# EAGLE design v4.5 (EAGLE 7.5.0)
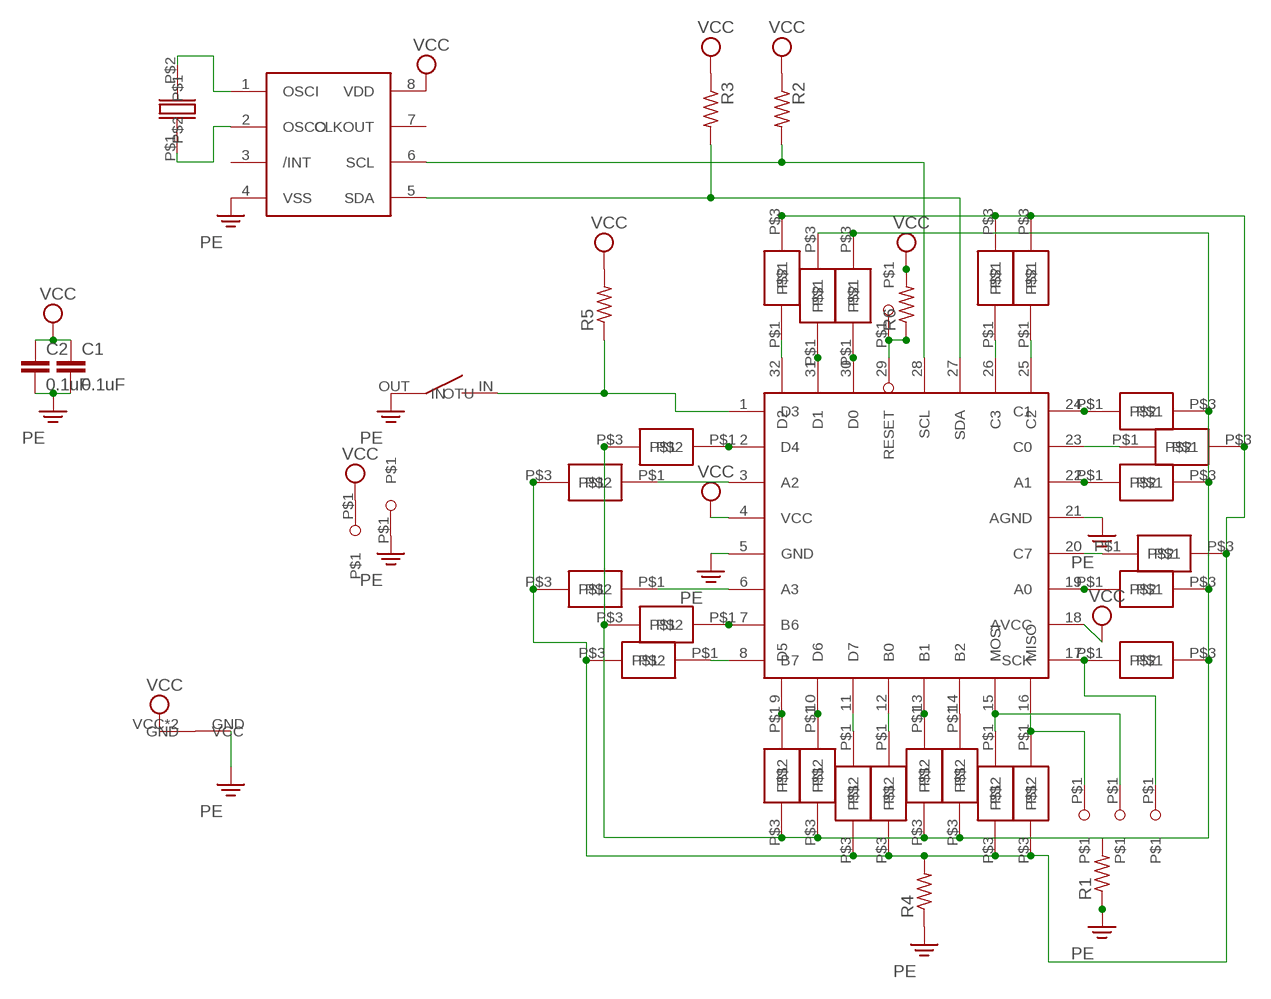
[diagram p0: schematic, sheet 1]

## Parts
C1  0.1uF  C-EUC0805K  [C0805K]
C2  0.1uF  C-EUC0805K  [C0805K]
R1  R-US_R0805  [R0805]
R2  R-US_R0805  [R0805]
R3  R-US_R0805  [R0805]
R4  R-US_R0805  [R0805]
R5  R-US_R0805  [R0805]
R6  R-US_R0805  [R0805]
U$1  SMDLED  [SMDLED]
U$2  SMDLED  [SMDLED]
U$3  SMDLED  [SMDLED]
U$4  SMDLED  [SMDLED]
U$5  SMDLED  [SMDLED]
U$6  SMDLED  [SMDLED]
U$7  SMDLED  [SMDLED]
U$8  SMDLED  [SMDLED]
U$9  SMDLED  [SMDLED]
U$10  SMDLED  [SMDLED]
U$11  SMDLED  [SMDLED]
U$12  SMDLED  [SMDLED]
U$13  SMDLED  [SMDLED]
U$14  SMDLED  [SMDLED]
U$15  SMDLED  [SMDLED]
U$16  SMDLED  [SMDLED]
U$17  SMDLED  [SMDLED]
U$18  SMDLED  [SMDLED]
U$19  SMDLED  [SMDLED]
U$20  SMDLED  [SMDLED]
U$21  SMDLED  [SMDLED]
U$22  SMDLED  [SMDLED]
U$23  SMDLED  [SMDLED]
U$24  SMDLED  [SMDLED]
U$25  ATTINY88  [32-TQFT]
U$26  PAD50  [PAD50]
U$27  BAT2009  [BAT2009]
U$28  INT2  [INT2]
U$29  SMDCRYSTAL  [SMDCRYSTAL]
U$30  RTC-SOIC  [8-SOIC]
U$31  PAD50  [PAD50]
U$32  PAD50  [PAD50]
U$33  PAD50  [PAD50]
U$34  PAD50  [PAD50]
U$35  PAD50  [PAD50]

## Nets
N$1: U$17.P$1 U$25.6(A3)
N$2: U$16.P$1 U$25.3(A2)
N$3: U$7.P$1 U$25.7(B6)
N$4: U$8.P$1 U$25.8(B7)
N$5: U$18.P$1 U$25.9(D5)
N$6: U$19.P$1 U$25.10(D6)
N$7: U$20.P$1 U$25.11(D7)
N$8: U$1.P$1 U$25.12(B0)
N$9: U$2.P$1 U$25.13(B1)
N$10: R1.2 U$2.P$3 U$3.P$3 U$6.P$3 U$7.P$3 U$11.P$3 U$12.P$3 U$13.P$3 U$15.P$3 U$18.P$3 U$19.P$3 U$21.P$3 U$23.P$3
N$11: U$3.P$1 U$25.14(B2)
N$12: R4.2 U$1.P$3 U$4.P$3 U$5.P$3 U$8.P$3 U$9.P$3 U$10.P$3 U$14.P$3 U$16.P$3 U$17.P$3 U$20.P$3 U$22.P$3 U$24.P$3
N$13: U$11.P$1 U$25.17(SCK) U$33.P$1
N$14: U$24.P$1 U$25.26(C3)
N$15: U$9.P$1 U$25.25(C2)
N$16: U$6.P$1 U$25.24(C1)
N$17: U$22.P$1 U$25.23(C0)
N$18: U$21.P$1 U$25.22(A1)
N$19: R5.1 U$25.1(D3) U$28.IN
N$20: U$10.P$1 U$25.20(C7)
N$21: U$23.P$1 U$25.30(D0)
N$22: U$13.P$1 U$25.31(D1)
N$23: U$14.P$1 U$25.32(D2)
N$24: U$15.P$1 U$25.2(D4)
N$25: U$29.P$2 U$30.1(OSCI)
N$26: U$12.P$1 U$25.19(A0)
N$29: U$29.P$1 U$30.2(OSCO)
N$30: R6.1 U$25.29(RESET) U$26.P$1
N$31: U$5.P$1 U$25.16(MISO) U$32.P$1
N$34: U$4.P$1 U$25.15(MOSI) U$31.P$1
PE: C1.2 C2.2 R1.1 R4.1 U$25.5(GND) U$25.21(AGND) U$27.GND U$28.OUT(OTU) U$30.4(VSS) U$34.P$1
SCL: R2.2 U$25.28(SCL) U$30.6(SCL)
SDA: R3.2 U$25.27(SDA) U$30.5(SDA)
VCC: C1.1 C2.1 R2.1 R3.1 R5.2 R6.2 U$25.4(VCC) U$25.18(AVCC) U$27.VCC U$27.VCC2(VCC) U$30.8(VDD) U$35.P$1
Unconnected: U$30.3(/INT) U$30.7(CLKOUT)

## Library data of the parts
C1 C2 = rcl:C-EU: CAPACITOR, European symbol
R1-R6 = resistor:R-US_: RESISTOR, American symbol
U$1-U$24 = custom:SMDLED
U$25 = _custom:ATTINY88
U$26 U$31-U$35 = _custom:PAD50
U$27 = custom:BAT2009
U$28 = custom:INT2
U$29 = _custom:SMDCRYSTAL
U$30 = _custom:RTC-SOIC

## Board
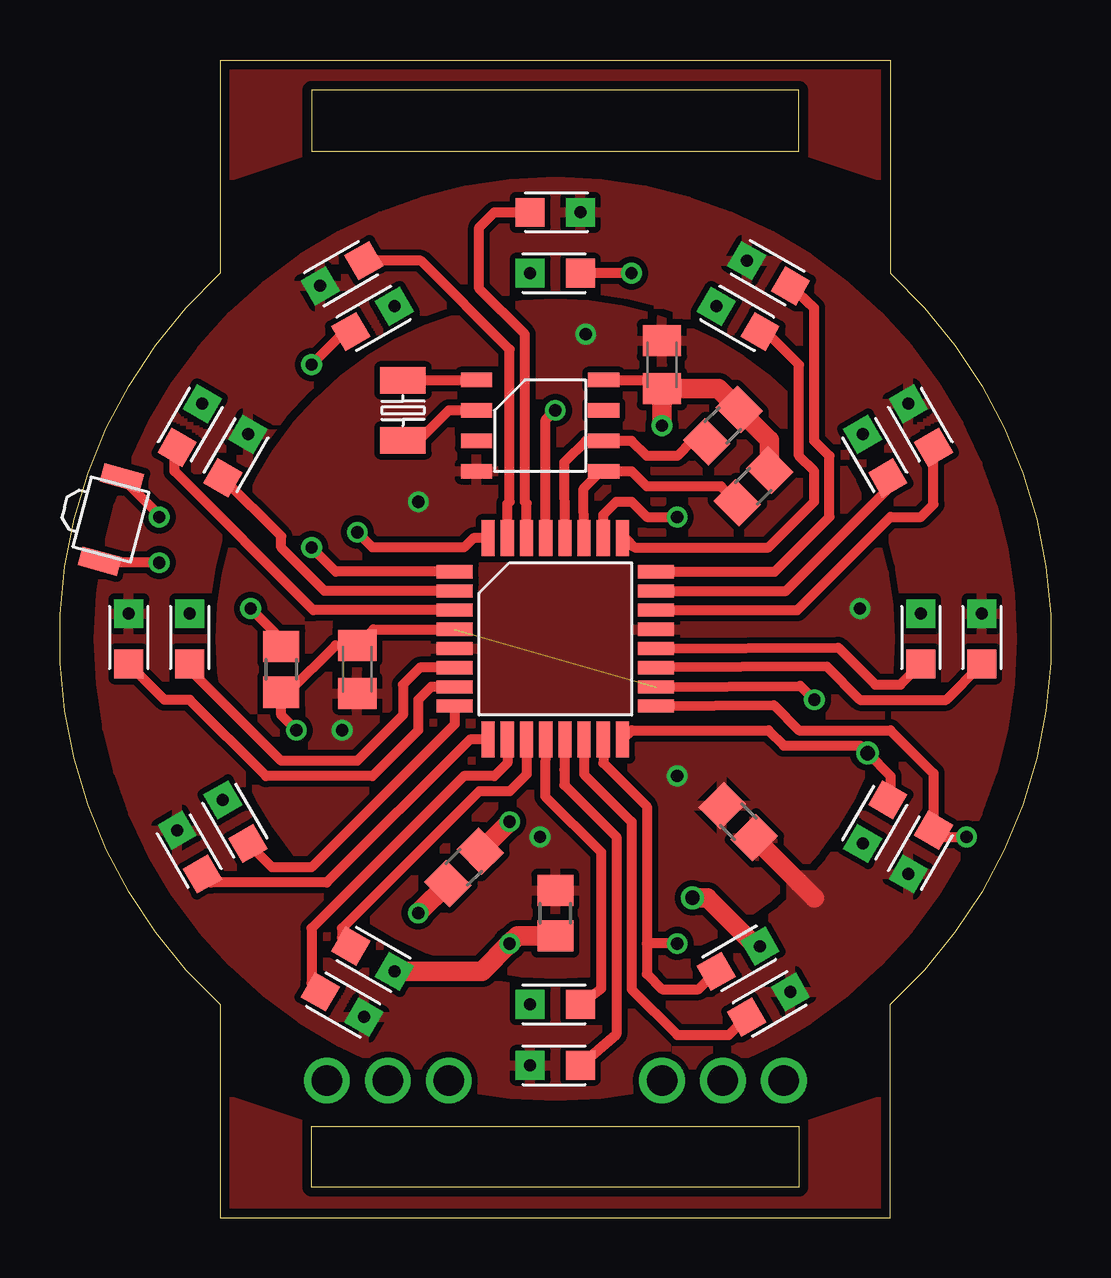
[diagram p1: board, top side]
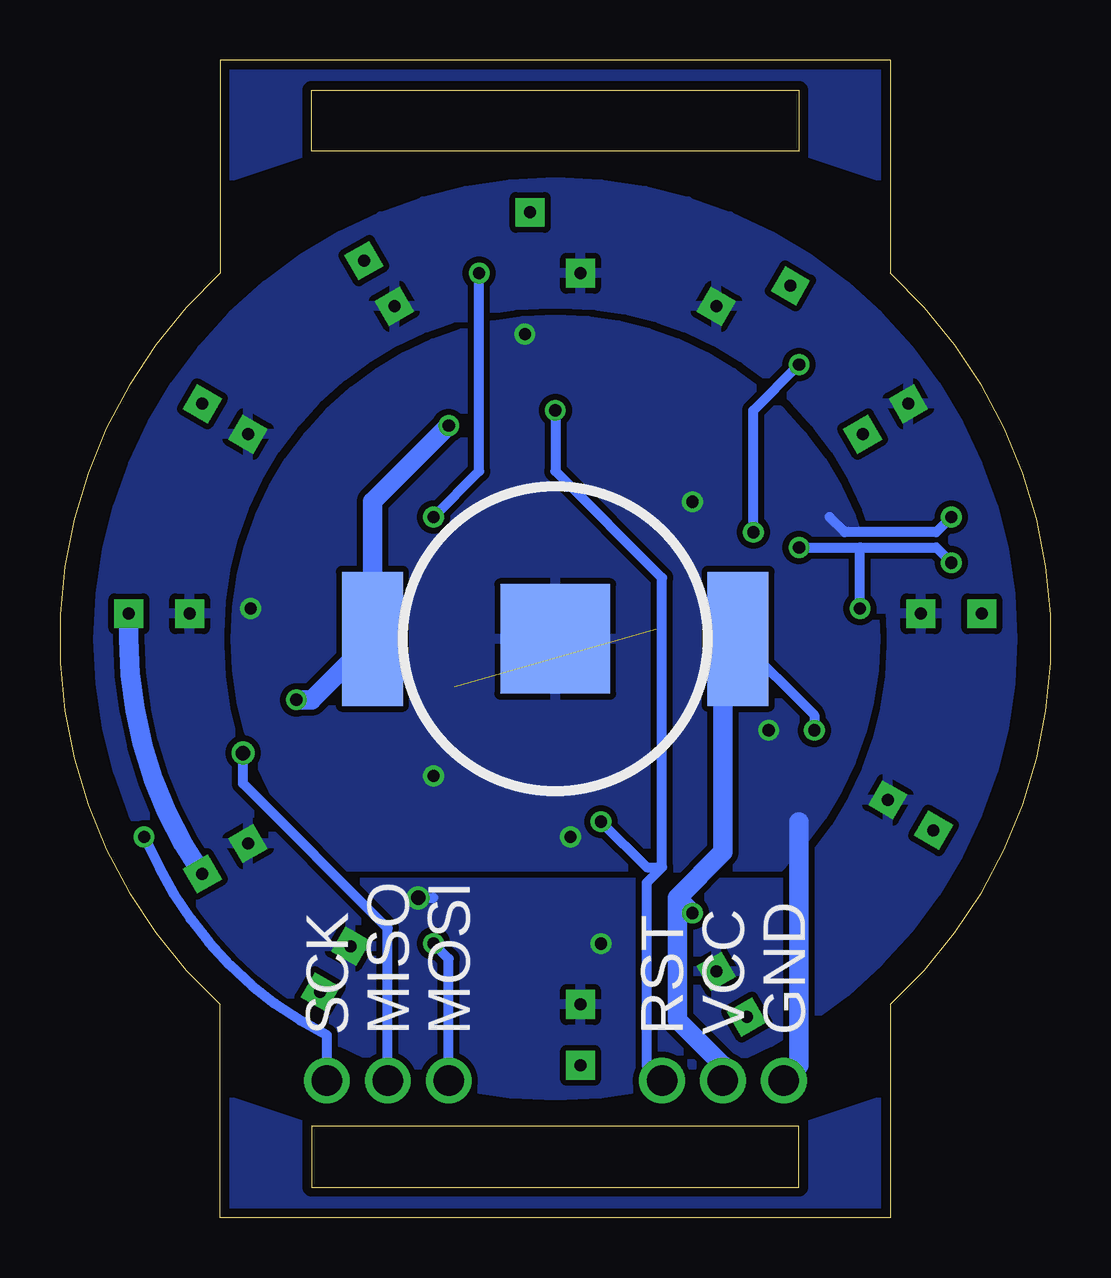
[diagram p2: board, bottom side, seen from below]

Size 41.3 x 48.26 mm. Coordinates in mm from the lower left corner, seen from the top.
Outline: 6.68,48.26 34.62,48.26 34.62,39.37 arc-95 34.62,8.89 34.62,0 6.68,0 6.68,8.89 arc-95 6.68,39.37 6.68,48.26
Outline: 30.81,46.99 10.49,46.99 10.49,44.45 30.81,44.45 30.81,46.99
Outline: 30.81,1.27 10.49,1.27 10.49,3.81 30.81,3.81 30.81,1.27
Copper layers (1*16): Top 0.0356mm / dielectric 1.5011mm / Bottom 0.0356mm
Design rules "oshpark-2layer": minimum track width 6mil, minimum drill 13mil, track to track 6mil, track to pad 6mil, pad to pad 6mil, via to via 6mil, smd to smd 6mil, copper to edge 15mil, drill to drill 6mil, minimum pad ring 7mil, minimum via ring 7mil, stop-mask expansion 2.5mil, vias tented up to drill 0mil, thermal gap 10mil

### Footprints (pad centres in the part's own frame; a part is rotated, then mirrored left to right if it is on the bottom)
C0805K = smd 1.3 x 1.6: 1 -1,0; 2 1,0
R0805 = smd 1.3 x 1.5: 1 -0.95,0; 2 0.95,0
SMDLED = smd 1.2 x 1.2: P$1 0,1.05 | drill 0.5 pad 1.2 square: P$3 0,-1.05
32-TQFT = smd 1.5 x 0.55: 1 -4.2,2.8; 2 -4.2,2; 3 -4.2,1.2; 4 -4.2,0.4; 5 -4.2,-0.4; 6 -4.2,-1.2; 7 -4.2,-2; 8 -4.2,-2.8; 17 4.2,-2.8; 18 4.2,-2; 19 4.2,-1.2; 20 4.2,-0.4; 21 4.2,0.4; 22 4.2,1.2; 23 4.2,2; 24 4.2,2.8 | smd 0.55 x 1.5: 9 -2.8,-4.2; 10 -2,-4.2; 11 -1.2,-4.2; 12 -0.4,-4.2; 13 0.4,-4.2; 14 1.2,-4.2; 15 2,-4.2; 16 2.8,-4.2; 25 2.8,4.2; 26 2,4.2; 27 1.2,4.2; 28 0.4,4.2; 29 -0.4,4.2; 30 -1.2,4.2; 31 -2,4.2; 32 -2.8,4.2
PAD50 = drill 1.27: P$1 0,0
BAT2009 = smd 4.572 x 4.572: GND 0,0 | smd 2.54 x 5.588: VCC -7.62,0; VCC2 7.62,0
INT2 = smd 0.8 x 1.7: IN -1.8,0; OUT 1.8,0
SMDCRYSTAL = smd 1.1 x 1.9: P$1 -1.25,0; P$2 1.25,0
8-SOIC = smd 1.3 x 0.6: 1 -2.65,1.905; 2 -2.65,0.635; 3 -2.65,-0.635; 4 -2.65,-1.905; 5 2.65,-1.905; 6 2.65,-0.635; 7 2.65,0.635; 8 2.65,1.905

### Placement (x,y rotation side)
C1  12.39,22.86 270 top
C2  25.09,35.56 90 top
R1  28.27,16.51 315 top
R2  27.63,33.02 225 top
R3  28.9,30.48 225 top
R4  20.65,12.7 270 top
R5  9.22,22.86 270 top
R6  16.84,14.61 225 top
U$1  20.65,8.89 270 top
U$2  20.65,6.35 270 top
U$3  29.54,8.89 120 top
U$4  28.27,10.8 120 top
U$5  33.98,16.51 330 top
U$6  29.54,39.37 240 top
U$7  2.87,24.13 180 top
U$8  7.31,16.51 210 top
U$9  28.27,37.47 240 top
U$10  35.89,24.13 180 top
U$11  35.89,15.24 330 top
U$12  38.43,24.13 180 top
U$13  11.76,39.37 300 top
U$14  13.03,37.47 120 top
U$15  7.31,31.75 150 top
U$16  5.41,33.02 150 top
U$17  5.41,24.13 180 top
U$18  5.41,15.24 210 top
U$19  11.76,8.89 60 top
U$20  13.03,10.8 60 top
U$21  35.89,33.02 210 top
U$22  33.98,31.75 210 top
U$23  20.65,41.91 90 top
U$24  20.65,39.37 270 top
U$25  20.65,24.13 0 top
U$26  16.2,5.71 180 top
U$27  20.65,24.13 0 bottom
U$28  2.12,29.1 75 top
U$29  14.3,33.66 90 top
U$30  20.01,33.02 0 top
U$31  25.09,5.71 180 top
U$32  27.63,5.71 180 top
U$33  30.17,5.71 180 top
U$34  11.12,5.71 180 top
U$35  13.66,5.71 180 top

### Tracks (layer width: path | path; a pad name or v marks a point on that pad's centre or on a via)
N$1
  Top 0.406: U$25.6 15,22.93 14.3,22.22 14.3,20.96 12.39,19.05 9.22,19.05 5.41,22.86 U$17.P$1
N$2
  Top 0.406: U$25.3 10.56,25.33 4.77,31.11 4.77,32 U$16.P$1
N$3
  Top 0.406: U$25.7 15.47,22.13 14.93,21.59 14.93,20.32 13.03,18.41 8.58,18.41 5.41,21.59 4.36,21.59 U$7.P$1
N$4
  Top 0.406: U$25.8 16.45,20.57 10.49,14.61 8.84,14.61 U$8.P$1
N$5
  Top 0.406: U$25.9 17.08,19.93 11.12,13.97 6.3,13.97 U$18.P$1
N$6
  Top 0.406: U$25.10 18.65,18.96 18.11,18.41 16.84,18.41 10.49,12.07 10.49,9.78 U$19.P$1
N$7
  Top 0.406: U$25.11 19.45,18.48 18.74,17.78 17.47,17.78 11.76,12.07 11.76,11.68 U$20.P$1
N$8
  Top 0.406: U$1.P$1 22.55,9.55 22.55,15.24 20.23,17.57 20.23,18.2 U$25.12
N$9
  Top 0.406: U$2.P$1 23.19,7.64 23.19,15.88 21.03,18.04 21.03,18.67 U$25.13
N$10
  Top 0.813: R1.2 30.81,13.97 | 30.81,13.97 | 30.81,13.97 31.44,13.34
  Bottom 0.813: U$12.P$3 38.43,24.13 arc-35 U$11.P$3
  pour Top (isolate 0.254, rank 3): 20.65,43.18 arc180 20.65,5.08 arc180
N$11
  Top 0.406: U$25.14 21.85,18.48 23.82,16.51 23.82,9.53 25.73,7.62 27.89,7.62 U$3.P$1
N$12  (via drill 0.51, 0.6)
  Top 0.813: R4.2 19.06,11.75 v18.74,11.43 17.58,10.27 U$20.P$3 | U$4.P$3 29.01,11.32 27,13.34 v26.36,13.34
  Bottom 0.406: v26.36,13.34 25.73,13.34
  pour Bottom (isolate 0.254, rank 3): 20.65,43.18 arc180 20.65,5.08 arc180
  pour Bottom (isolate 0.254): 30.81,13.97 10.49,13.97 11.76,12.7 arc90 29.54,12.7
N$13  (via drill 0.51)
  Top 0.406: U$25.17 29.76,21.37 30.81,20.32 34.62,20.32 36.41,18.53 U$11.P$1 36.69,15.88 v37.79,15.88
  Bottom 0.406: v37.79,15.88 37.16,14.61 arc-37 30.17,7.62 U$33.P$1
N$14  (via drill 0.51)
  Top 0.406: U$25.26 22.65,29.31 23.19,29.85 23.82,29.85 24.46,29.21 v25.73,29.21 | v23.82,39.37 U$24.P$1
  Bottom 0.406: v25.73,29.21 23.82,31.11 v23.82,39.37
N$15
  Top 0.406: U$9.P$1 29.53,36.84 30.81,35.56 30.81,31.75 31.44,31.11 31.44,29.85 29.54,27.94 23.96,27.94 23.57,28.33 U$25.25
N$16
  Top 0.406: U$6.P$1 31.44,37.92 31.44,32.39 32.08,31.75 32.08,29.21 29.8,26.93 U$25.24
N$17
  Top 0.406: U$25.23 30.27,26.13 34.51,30.37 U$22.P$1
N$18
  Top 0.406: U$25.22 30.74,25.33 34.62,29.21 35.89,29.21 36.41,29.74 U$21.P$1
N$19  (via drill 0.51)
  Top 0.406: U$25.1 11.5,26.93 v10.49,27.94 | v4.14,27.31 1.72,27.31 U$28.IN | R5.1 9.22,24.13 v7.95,25.4
  Bottom 0.406: v10.49,27.94 7.95,27.94 | 7.95,27.94 4.77,27.94 v4.14,27.31 | v7.95,25.4 7.95,27.94
N$20
  Top 0.406: U$25.20 32.44,23.77 33.98,22.22 35.03,22.22 U$10.P$1
N$21
  Top 0.406: U$25.30 19.45,29.78 19.38,29.85 19.38,36.83 17.47,38.73 17.47,41.28 18.11,41.91 U$23.P$1
N$22
  Top 0.406: U$25.31 18.65,29.75 18.74,29.85 18.74,36.2 15.04,39.89 U$13.P$1
N$23  (via drill 0.51)
  Top 0.406: U$25.32 17.23,28.33 16.84,27.94 13.03,27.94 v12.39,28.57 | v10.49,35.56 11.87,36.94 U$14.P$1
  Bottom 0.406: v12.39,28.57 12.39,33.66 v10.49,35.56
N$24
  Top 0.406: U$25.2 11.03,26.13 9.22,27.94 9.22,28.41 U$15.P$1
N$25
  Top 0.406: U$29.P$2 14.32,34.92 U$30.1
N$26
  Top 0.406: U$12.P$1 36.94,21.59 33.35,21.59 31.97,22.97 U$25.19
N$27
  pour Top (isolate 0.254, rank 6): 6.68,48.26 34.62,48.26 34.62,43.18 30.81,44.45 30.81,46.99 10.49,46.99 10.49,44.45 6.68,43.18
N$28
  pour Bottom (isolate 0.254, rank 6): 6.68,48.26 34.62,48.26 34.62,43.18 30.81,44.45 30.81,46.99 10.49,46.99 10.49,44.45 6.68,43.18
N$29
  Top 0.406: U$30.2 16.2,33.66 14.95,32.41 U$29.P$1
N$30  (via drill 0.51)
  Top 0.406: U$25.29 20.25,33.25 v20.65,33.66
  Top 0.813: R6.1 v18.74,16.51
  Bottom 0.406: v20.65,33.66 20.65,31.11 16.2,26.67 16.2,14.61 | U$26.P$1 16.84,6.35 16.84,13.97 16.2,14.61 | v18.74,16.51 16.84,14.61 16.2,14.61
N$31  (via drill 0.6)
  Top 0.406: U$25.16 23.84,20.32 29.54,20.32 30.17,19.68 33.35,19.68 v33.67,19.37 34.62,18.41 34.62,17.53 U$5.P$1
  Bottom 0.406: U$32.P$1 27.63,12.07 33.67,18.1 v33.67,19.37
N$32
  pour Bottom (isolate 0.254, rank 6): 10.49,3.81 6.68,5.08 6.68,0 34.62,0 34.62,5.08 30.81,3.81 30.81,1.27 10.49,1.27
N$33
  pour Top (isolate 0.254, rank 6): 6.68,5.08 6.68,0 34.62,0 34.62,5.08 30.81,3.81 30.81,1.27 10.49,1.27 10.49,3.81
N$34  (via drill 0.51)
  Top 0.406: U$25.15 22.65,18.96 24.46,17.14 24.46,11.43 | 24.46,11.43 24.46,10.16 25.09,9.53 26.62,9.53 U$4.P$1 | v25.73,11.43 24.46,11.43
  Bottom 0.406: U$31.P$1 25.09,10.8 v25.73,11.43
PE  (via drill 0.51)
  Top 0.406: U$28.OUT 4.14,29.29 v4.14,29.21
  Bottom 0.406: v4.14,29.21 4.77,28.57 8.58,28.57 9.22,29.21
  Bottom 0.813: U$34.P$1 10.49,6.35 10.49,16.51
  other vias: 20.01,15.88 11.76,20.32 21.92,36.83 25.73,18.41 14.93,29.85 33.35,25.4
  pour Bottom: 
  pour Bottom: 
  pour Top (isolate 0.254): 20.65,10.16 arc180 20.65,38.1 arc180
  pour Bottom (isolate 0.254, rank 2): 20.65,10.8 arc180 20.65,37.47 arc180
SCL
  Top 0.406: U$25.28 21.03,31.49 21.92,32.39 U$30.6 23.82,32.39 24.46,31.75 25.73,31.75 26.33,32.35 R2.2
SDA
  Top 0.406: U$25.27 21.83,30.39 22.55,31.11 U$30.5 23.82,31.11 24.46,30.48 27.56,30.48 R3.2
VCC  (via drill 0.51)  (1 unrouted)
  Top 0.406: U$25.18 30.86,22.17 v31.44,21.59 | U$25.4 13.06,24.53 C1.1 11.49,23.86 9.54,21.91 R5.2 9.22,20.96 v9.85,20.32 | U$30.8 24.73,34.92 C2.1
  Top 0.813: R3.1 29.58,32.42 R2.1 27.44,34.56 C2.1 v25.09,33.02 | R6.2 v14.93,12.7
  Bottom 0.406: U$27.VCC2 9.85,20.96 v9.85,20.32
  Bottom 0.813: v31.44,21.59 30.81,21.59 U$27.VCC 28.27,29.85 v25.09,33.02 | U$27.VCC2 13.03,22.86 13.66,22.22 13.66,15.24 15.57,13.34 | U$35.P$1 13.66,6.35 15.57,8.25 15.57,13.34 | v14.93,12.7 15.57,13.34

### Text on the board
bPlace: GND | VCC | RST | MOSI | MISO | SCK